# Altium schematic sheet Power.SchDoc
size A4; SheetNumber: 8; SheetTotal: 11
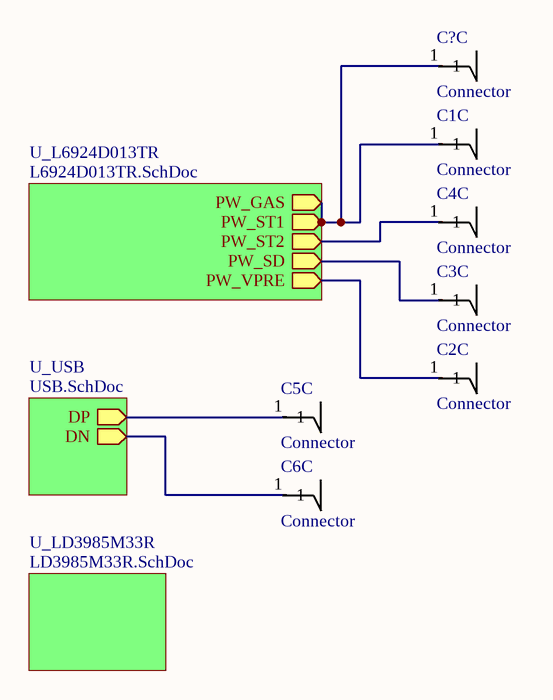
[diagram p0: Power.SchDoc]

## Parts
C1  Connector  (part C of 3)
C2  Connector  (part C of 3)
C3  Connector  (part C of 3)
C4  Connector  (part C of 3)
C5  Connector  (part C of 3)
C6  Connector  (part C of 3)
C?  Connector  (part C of 3)

## Sub-sheets
U_L6924D013TR = L6924D013TR.SchDoc: PW_GAS (out), PW_ST1 (out), PW_ST2 (out), PW_SD (out), PW_VPRE (out)
U_LD3985M33R = LD3985M33R.SchDoc: no entries
U_USB = USB.SchDoc: DP (out), DN (out)

## Nets
NetC1_1: C1.1 C?.1 ; sheet U_L6924D013TR/PW_GAS, sheet U_L6924D013TR/PW_ST1
NetC2_1: C2.1 ; sheet U_L6924D013TR/PW_VPRE
NetC3_1: C3.1 ; sheet U_L6924D013TR/PW_SD
NetC4_1: C4.1 ; sheet U_L6924D013TR/PW_ST2
NetC5_1: C5.1 ; sheet U_USB/DP
NetC6_1: C6.1 ; sheet U_USB/DN